# Altium project KD_Praca_Inzynierska.PrjPcb
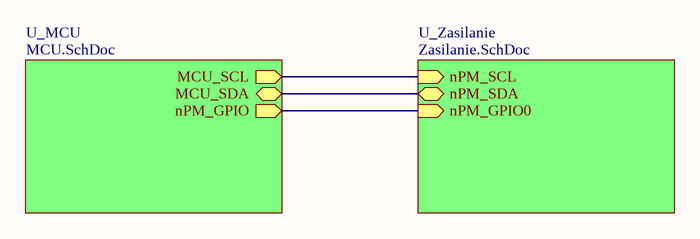
[diagram p0: Schemat_blokowy.SchDoc]
3 sheets, 45 parts. Net scope: hierarchical (ports join the sheet entries above them; power ports are global).
Board file: PCB1.PcbDoc
Sheets:
  Schemat_blokowy.SchDoc
    U_Zasilanie = Zasilanie.SchDoc
    U_MCU = MCU.SchDoc

## Sheet Schemat_blokowy.SchDoc
size A4; SheetNumber: 1; SheetTotal: 3

### Sub-sheets
U_MCU = MCU.SchDoc: MCU_SCL (out), MCU_SDA (bidir), nPM_GPIO (out)
U_Zasilanie = Zasilanie.SchDoc: nPM_SCL (in), nPM_SDA (bidir), nPM_GPIO0 (in)

### Nets
NetR3_1: sheet U_Zasilanie/nPM_SCL, sheet U_MCU/MCU_SCL
NetR4_1: sheet U_Zasilanie/nPM_SDA, sheet U_MCU/MCU_SDA
NetU1_7: sheet U_Zasilanie/nPM_GPIO0, sheet U_MCU/nPM_GPIO

## Sheet Zasilanie.SchDoc
size A4; SheetNumber: 2; SheetTotal: 3
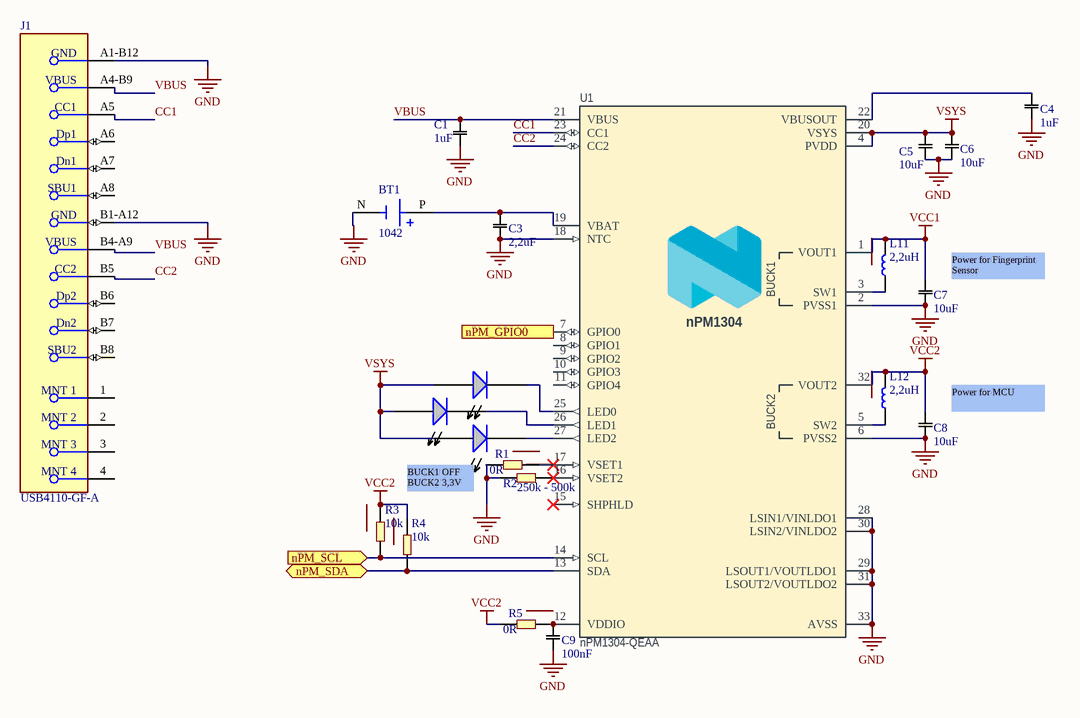
[diagram p1: Zasilanie.SchDoc]

### Parts
BT1  1042  [BAT_1042]
C1  1uF  [0402C]
C3  2,2uF  [0402C]
C4  1uF  [0402C]
C5  10uF  [0402C]
C6  10uF  [0402C]
C7  10uF  [0402C]
C8  10uF  [0402C]
C9  100nF  [0402C]
D1  LED  [0603LED_RED]  (value not drawn)
D2  LED  [0603LED_RED]  (value not drawn)
D3  LED  [0603LED_RED]  (value not drawn)
J1  USB4110-GF-A  [FP-USB4110-GF-A-MFG]
L11  2,2uH  [0402L]
L12  2,2uH  [0402L]
R1  0R  [0402R]
R2  250k - 500k  [0402R]
R3  10k  [0402R]
R4  10k  [0402R]
R5  0R  [0402R]
U1  nPM1304-QEAA  [Nordic_QFN50P500X500X90-33N]

### Ports
nPM_GPIO0 (in, see Schemat_blokowy[3B]), nPM_SCL (in, see Schemat_blokowy[3B]), nPM_SDA (bidir, see Schemat_blokowy[3B])

### Nets
GND: BT1.N(NEG) C1.1 C3.1 C4.2 C5.2 C6.2 C7.2 C8.2 C9.1 J1.A1-B12(GND) J1.B1-A12(GND) R1.1 R2.1 U1.2(PVSS1) U1.6(PVSS2) U1.18(NTC) U1.28(LSIN1/VINLDO1) U1.29(LSOUT1/VOUTLDO1) U1.30(LSIN2/VINLDO2) U1.31(LSOUT2/VOUTLDO2) U1.33(AVSS)
VCC1: C7.1 L11.2 U1.1(VOUT1)
VCC2: C8.1 L12.2 R3.2 R4.2 R5.1 U1.32(VOUT2)
VSYS: C5.1 C6.1 D1.2 D2.2 D3.2 U1.4(PVDD) U1.20(VSYS)
CC1: J1.A5(CC1) U1.23(CC1)
CC2: J1.B5(CC2) U1.24(CC2)
VBUS: C1.2 J1.A4-B9(VBUS) J1.B4-A9(VBUS) U1.21(VBUS)
NetBT1_P: BT1.P(POS) C3.2 U1.19(VBAT)
NetC4_1: C4.1 U1.22(VBUSOUT)
NetC9_2: C9.2 R5.2 U1.12(VDDIO)
NetD1_1: D1.1 U1.25(LED0)
NetD2_1: D2.1 U1.26(LED1)
NetD3_1: D3.1 U1.27(LED2)
NetL11_1: L11.1 U1.3(SW1)
NetL12_1: L12.1 U1.5(SW2)
NetR1_2: R1.2 U1.17(VSET1)
NetR2_2: R2.2 U1.16(VSET2)
NetR3_1: R3.1 U1.14(SCL) ; port nPM_SCL
NetR4_1: R4.1 U1.13(SDA) ; port nPM_SDA
NetU1_7: U1.7(GPIO0) ; port nPM_GPIO0

Not connected (* = marked no-connect by the designer): J1 1(MNT_1) 2(MNT_2) 3(MNT_3) 4(MNT_4) A6(Dp1) A7(Dn1) A8(SBU1) B6(Dp2) B7(Dn2) B8(SBU2); U1 8(GPIO1) 9(GPIO2) 10(GPIO3) 11(GPIO4) 15(SHPHLD)*

### Notes on the sheet
- (near C7) Power for Fingerprint Sensor
- (near C8) Power for MCU
- BUCK1 OFF
  BUCK2 3,3V
- (in symbol nPM1304_QEAA) BUCK1; nPM1304; BUCK2

### Library data of the parts
BT1 = 1042: SMT Holder for 18650 Battery; MF: Keystone Electronics Corp.; SnapEDA_Link: https://www.snapeda.com/parts/1042/Keystone/view-part/?ref=snap; Package: NON STANDARD-5 Keystone; Value: *; MP: 1042; Check_prices: https://www.snapeda.com/parts/1042/Keystone/view-part/?ref=eda
C1 C3-C9 = C: Capacitor
  C1 C4: Value: 1uF
  C3: Value: 2,2uF
  C5-C8: Value: 10uF
  C9: Value: 100nF
J1 = USB-C: USB-C Connector, CMP-245163-000002-1; Manufacturer: GCT; Conn Orientation: Right Angle; Usb Standard: USB 2.0; Voltage Rating: 20V; Current Rating: 3/4.25/1.25/0.25A; Number Of Contacts: 16; Is Female: yes; Shielding: true; Standoff Height: 0.1mm; Octopart: https://octopart.com/usb4110-gf-a-gct-103941985; Temperature: -40°C to +85°C; RoHS: TRUE; Automotive: No; Contact Material: Gold,Nickel; Device Class L1: Connectors; Device Class L2: USB Connectors; Package: 0; Lead Free: Yes; ComponentLink2URL: https://gct.co/files/drawings/usb4110.pdf; Temperature Range High: +85°C; Temperature Range Low: -40°C; Height: 3.46mm; Manufacturer Part Number: USB4110-GF-A; ComponentLink2Description: Datasheet; Device Class L3: unset; Digikey Description: CONN USB 2.0 TYPE-C R/A SMT; Category: Conn
L11 L12 = L: Inductor; Value: 2,2uH
R1-R5 = R: Resistor
  R1 R5: Value: 0R
  R2: Value: 250k - 500k
  R3 R4: Value: 10k
U1 = nPM1304_QEAA: Li-Ion/Li-Polymer USB-C battery charger with high efficiency buck regulators, LDOs or load switches, LED drivers, TWI and VBUSOUT; Manufacturer: Nordic Semiconductor; Part number NEMS: 102000396; Component Status: Active; Pad Count: 33; Artikkelnr Noca: N.A.; Part Number: nPM1304-QEAA; Component Class: Nordic_Devices; Author: eisk; Manufacturer Part Number: nPM1304-QEAA; ComponentLink1URL: N.A.; ComponentLink1Description: Datasheet; ComponentLink2URL: N.A.; ComponentLink2Description: Supplier link; HelpURL: N.A.; LatestRevisionDate: 2025-03-07; Published: 2025-03-07; Footprint Doc: QFN-32; Value: nPM1304-QEAA; Supplier 1: Nordic Semiconductor; Supplier Part Number 1: nPM1304-QEAA; Supplier 2: N.A.; Supplier Part Number 2: N.A.; Part number IPS: N.A.; Part number Norautron: N.A.; PartId: 102000396

## Sheet MCU.SchDoc
size A4; SheetNumber: 3; SheetTotal: 3
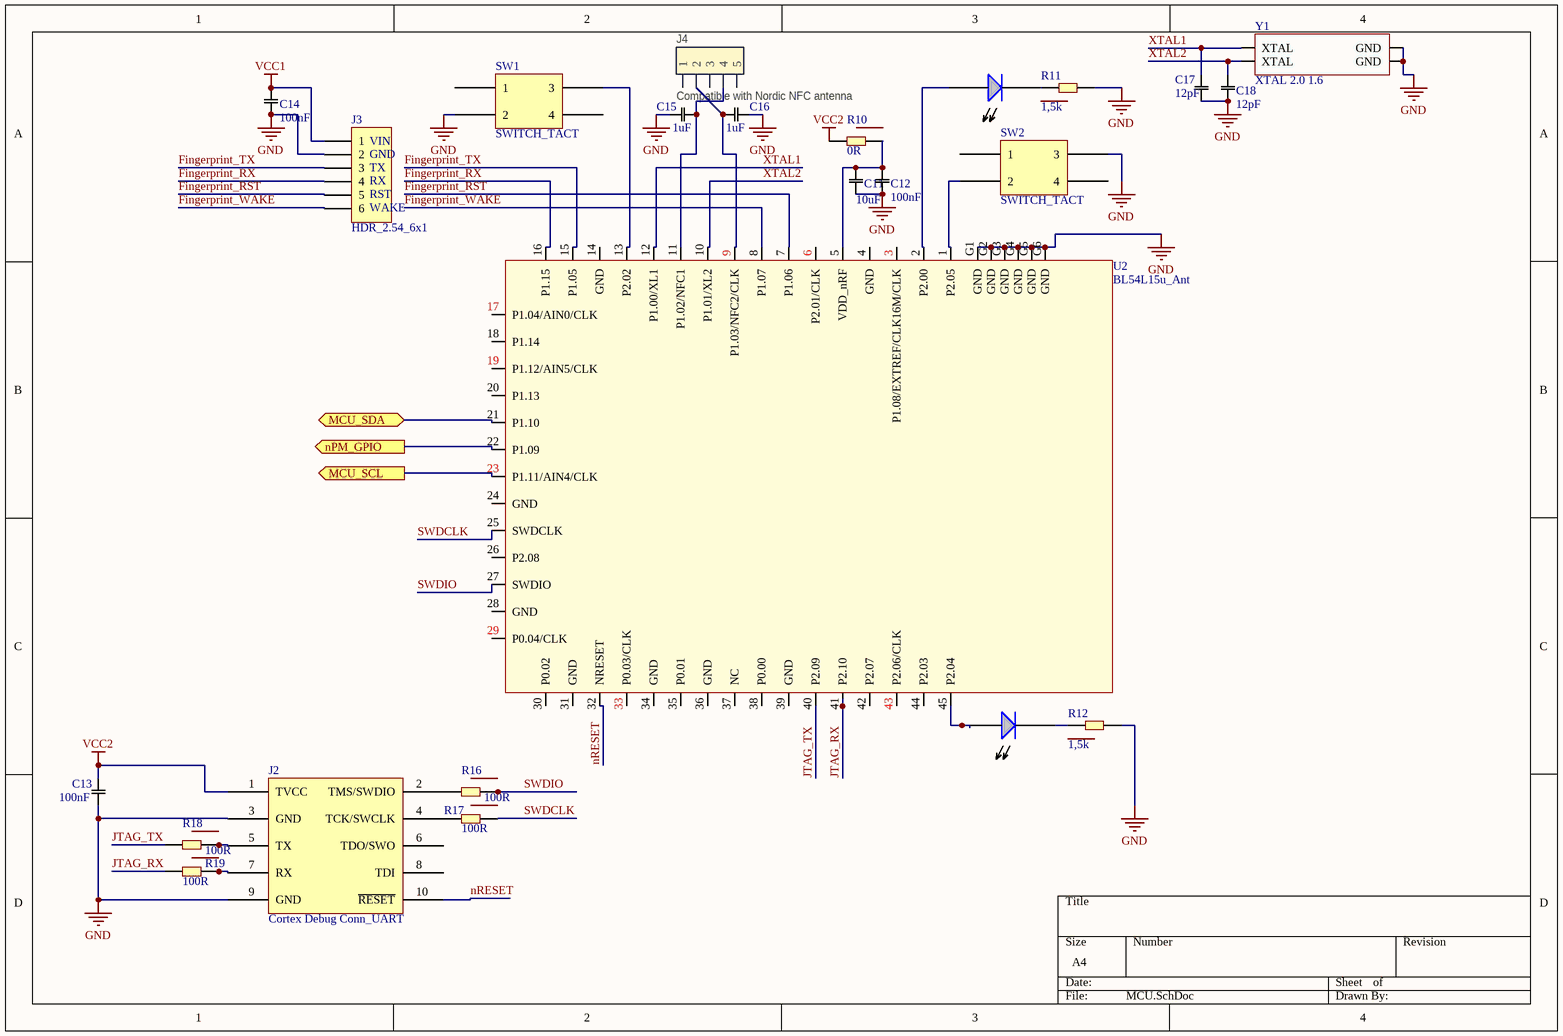
[diagram p2: MCU.SchDoc]

### Parts
C11  10uF  [0402C]
C12  100nF  [0402C]
C13  100nF  [0402C]
C14  100nF  [0402C]
C15  1uF  [0402C]
C16  1uF  [0402C]
C17  12pF  [0402C]
C18  12pF  [0402C]
D11  LED  [0603LED_RED]  (value not drawn)
D12  LED  [0603LED_RED]  (value not drawn)
J2  Cortex Debug Conn_UART  [Cortex Debug Connector - THT]
J3  HDR_2.54_6x1  [HDR 2.54MM 1x6]
J4  Compatible with Nordic NFC antenna  [FPC_05P-0.5mm-RA-SMD]
R10  0R  [0402R]
R11  1,5k  [0402R]
R12  1,5k  [0402R]
R16  100R  [0402R]
R17  100R  [0402R]
R18  100R  [0402R]
R19  100R  [0402R]
SW1  SWITCH_TACT  [TACT - SMD]
SW2  SWITCH_TACT  [TACT - SMD]
U2  BL54L15u_Ant  [Ezurio, BL54L15u Module, Antenna, Platform Side]
Y1  XTAL 2.0 1.6  [XTAL 2.0 1.6]

### Ports
MCU_SCL (out, see Schemat_blokowy[2B]), MCU_SDA (bidir, see Schemat_blokowy[2B]), nPM_GPIO (out, see Schemat_blokowy[2B])

### Nets
GND: C11.2 C12.2 C13.1 C14.1 C15.1 C16.2 C17.2 C18.2 J2.3(GND) J2.9(GND) J3.2 R11.1 R12.1 SW1.2 SW2.3 U2.G1(GND) U2.G2(GND) U2.G3(GND) U2.G4(GND) U2.G5(GND) U2.G6(GND) Y1.2(GND) Y1.4(GND)
VCC1: C14.2 J3.1
VCC2: C13.2 J2.1(TVCC) R10.1
Fingerprint_RST: J3.5 U2.7(P1.06)
Fingerprint_RX: J3.4 U2.16(P1.15)
Fingerprint_TX: J3.3 U2.15(P1.05)
Fingerprint_WAKE: J3.6 U2.8(P1.07)
JTAG_RX: R19.1 U2.41(P2.10)
JTAG_TX: R18.1 U2.40(P2.09)
nRESET: J2.10(~{RESET}) U2.32(NRESET)
SWDCLK: R17.2 U2.25(SWDCLK)
SWDIO: R16.2 U2.27(SWDIO)
XTAL1: C17.1 U2.12(P1.00/XL1) Y1.3(XTAL)
XTAL2: C18.1 U2.10(P1.01/XL2) Y1.1(XTAL)
NetC11_1: C11.1 C12.1 R10.2 U2.5(VDD_nRF)
NetC15_2: C15.2 J4.4 U2.11(P1.02/NFC1)
NetC16_1: C16.1 J4.2 U2.9(P1.03/NFC2/CLK)
NetD11_1: D11.1 R11.2
NetD11_2: D11.2 U2.2(P2.00)
NetD12_1: D12.1 R12.2
NetD12_2: D12.2 U2.45(P2.04)
NetJ2_2: J2.2(TMS/SWDIO) R16.1
NetJ2_4: J2.4(TCK/SWCLK) R17.1
NetJ2_5: J2.5(TX) R18.2
NetJ2_7: J2.7(RX) R19.2
NetR3_1: U2.23(P1.11/AIN4/CLK) ; port MCU_SCL
NetR4_1: U2.21(P1.10) ; port MCU_SDA
NetSW1_3: SW1.3 U2.13(P2.02)
NetSW2_2: SW2.2 U2.1(P2.05)
NetU1_7: U2.22(P1.09) ; port nPM_GPIO

Not connected (* = marked no-connect by the designer): J2 6(TDO/SWO) 8(TDI); J4 1 3 5; SW1 1 4; SW2 1 4; U2 3(P1.08/EXTREF/CLK16M/CLK) 4(GND) 6(P2.01/CLK) 14(GND) 17(P1.04/AIN0/CLK) 18(P1.14) 19(P1.12/AIN5/CLK) 20(P1.13) 24(GND) 26(P2.08) 28(GND) 29(P0.04/CLK) 30(P0.02) 31(GND) 33(P0.03/CLK) 34(GND) 35(P0.01) 36(GND) 37(NC) 38(P0.00) 39(GND) 42(P2.07) 43(P2.06/CLK) 44(P2.03)

### Notes on the sheet
- (near J3) VIN
- (near J3) GND
- (near J3) TX
- (near J3) RX
- (near J3) RST
- (near J3) WAKE

### Library data of the parts
C11-C18 = C: Capacitor
  C11: Value: 10uF
  C12-C14: Value: 100nF
  C15 C16: Value: 1uF
  C17 C18: Value: 12pF
J2 = Cortex Debug Conn_UART: JTAG10 Connector
J3 = HDR_2.54_6x1: Header 2.54, 6-Pin; LatestRevisionDate: 17-Jul-2002; LatestRevisionNote: Re-released for DXP Platform.; Publisher: Altium Limited
J4 = NFC_CONN: 0.5mm FPC, 5P,Right Angle SMT,Double Contact,H=1.2mm,White, Tin plated; Manufacturer: WCON; Manufacturer Part Number: 5141-05RZDNWR03; Part number NEMS: 100500528; Value: FPC 0.5mm RA SMD; Note: (Replaced 5141-05RZDNWR02); Artikkelnr Noca: N.A.; Pad Count: 7; Component Status: Active; System: Connector; Part Number: FPC_05P-0.5mm-RA-SMD; Footprint Doc: FPC_05P-0.5mm-RA-SMD; LatestRevisionDate: 2024-02-02; Published: 2015-06-22; Part number IPS: N.A.; ComponentLink1URL: N.A.; ComponentLink1Description: Datasheet; ComponentLink2URL: N.A.; ComponentLink2Description: Supplier link; HelpURL: \\hizz\pro\app9717\Datasheet\connectors\W-CON\5141-05RZDNXX02.pdf; Supplier 1: Cabcon; Supplier Part Number 1: 5141-05RZDNWR03; Supplier 2: N.A.; Supplier Part Number 2: N.A.; Component Class: Connectors; PartId: 100500528; Author: rsk; Part number Norautron: N.A.
R10-R12 R16-R19 = R: Resistor
  R10: Value: 0R
  R11 R12: Value: 1,5k
  R16-R19: Value: 100R
SW1 SW2 = SWITCH_TACT: Switch tact
U2 = BL54L15u_Ant: 453-00223_BL54L15u_Chip ANT_SCH_Symbol_Altium
Y1 = XTAL 2.0 1.6: XTAL

## Nets that join several sheets
GND: Zasilanie (21 pins), MCU (23 pins)
VCC1: Zasilanie (C7.1 L11.2 U1.1), MCU (C14.2 J3.1)
VCC2: Zasilanie (6 pins), MCU (C13.2 J2.1 R10.1)
NetR3_1: Zasilanie (R3.1 U1.14), MCU (U2.23)
NetR4_1: Zasilanie (R4.1 U1.13), MCU (U2.21)
NetU1_7: Zasilanie (U1.7), MCU (U2.22)